# Altium project Mach cau H.PrjPcb
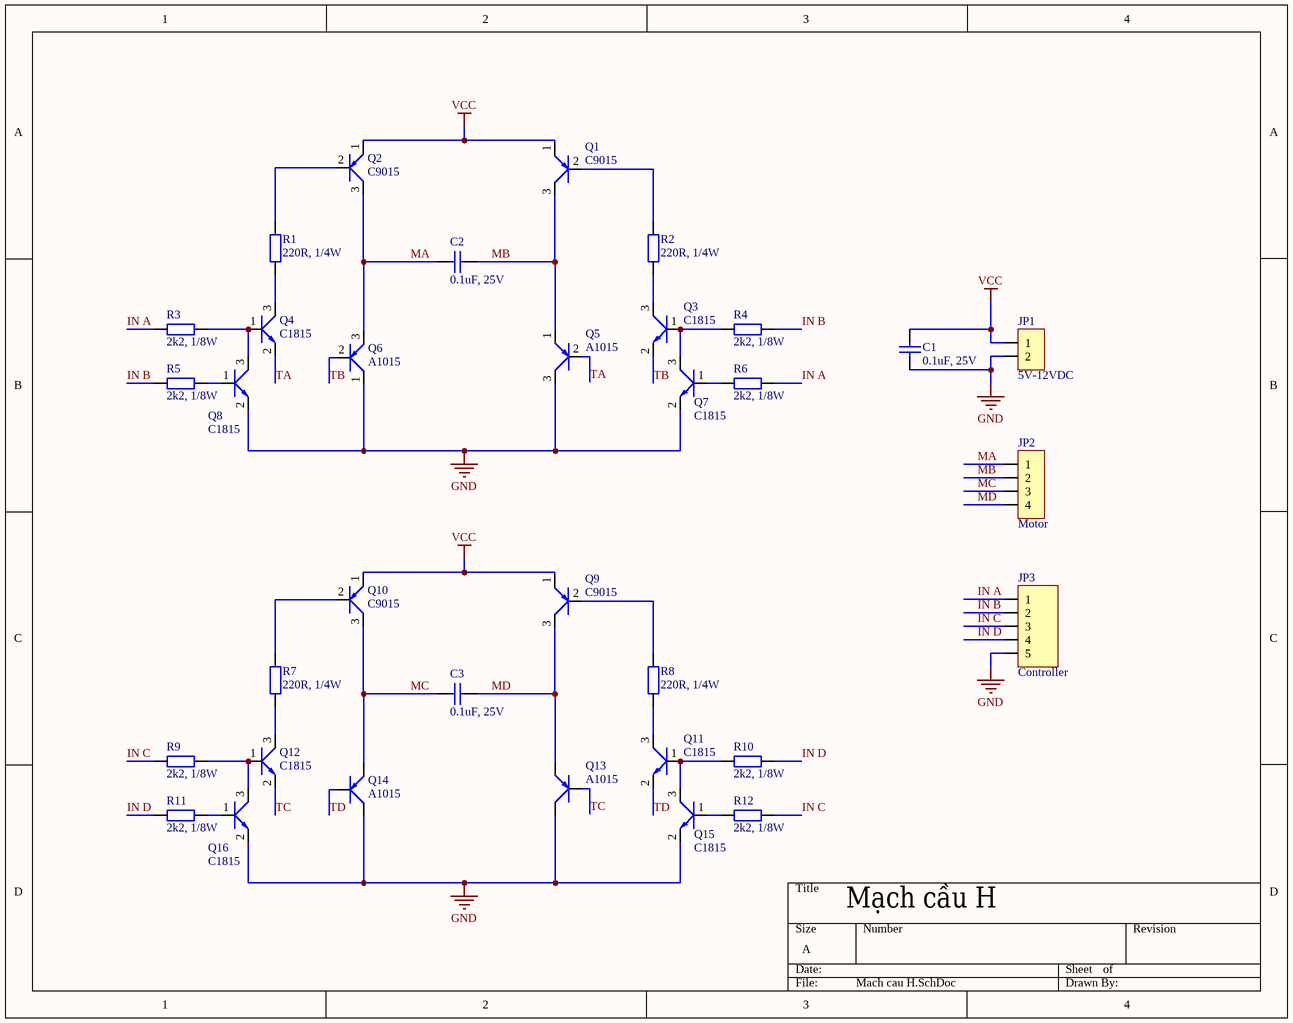
[diagram p0: Mach cau H.SchDoc]
1 sheet, 34 parts. Net scope: global (net labels, ports and power ports of the same name join across sheets).
Board file: Mach cau H.PcbDoc

## Sheet Mach cau H.SchDoc
size A; SheetNumber: 1; SheetTotal: 1

### Parts
C1  0.1uF, 25V  [tu gom]
C2  0.1uF, 25V  [tu gom]
C3  0.1uF, 25V  [tu gom]
JP1  5V-12VDC  [JP 1x2 CT]
JP2  Motor  [JP 1x4 CT]
JP3  Controller  [JP 1x5 CT]
Q1  C9015  [QTO-92]
Q2  C9015  [QTO-92]
Q3  C1815  [QTO-92]
Q4  C1815  [QTO-92]
Q5  A1015  [TO92]
Q6  A1015  [TO92]
Q7  C1815  [QTO-92]
Q8  C1815  [QTO-92]
Q9  C9015  [QTO-92]
Q10  C9015  [QTO-92]
Q11  C1815  [QTO-92]
Q12  C1815  [QTO-92]
Q13  A1015  [TO92]
Q14  A1015  [TO92]
Q15  C1815  [QTO-92]
Q16  C1815  [QTO-92]
R1  220R, 1/4W  [tro vach 1/4w]
R2  220R, 1/4W  [tro vach 1/4w]
R3  2k2, 1/8W  [R1/4W]
R4  2k2, 1/8W  [R1/4W]
R5  2k2, 1/8W  [R1/4W]
R6  2k2, 1/8W  [R1/4W]
R7  220R, 1/4W  [tro vach 1/4w]
R8  220R, 1/4W  [tro vach 1/4w]
R9  2k2, 1/8W  [R1/4W]
R10  2k2, 1/8W  [R1/4W]
R11  2k2, 1/8W  [R1/4W]
R12  2k2, 1/8W  [R1/4W]

### Nets
GND: C1.2 JP1.2 JP3.5 Q5.3(E) Q6.1(E) Q7.2(E) Q8.2(E) Q13.2(C) Q14.2(C) Q15.2(E) Q16.2(E)
VCC: C1.1 JP1.1 Q1.1(E) Q2.1(E) Q9.1(E) Q10.1(E)
IN A: JP3.1 R3.1 R6.1
IN B: JP3.2 R4.1 R5.1
IN C: JP3.3 R9.1 R12.1
IN D: JP3.4 R10.1 R11.1
MA: C2.1 JP2.1 Q2.3(C) Q6.3(C)
MB: C2.2 JP2.2 Q1.3(C) Q5.1(C)
MC: C3.1 JP2.3 Q10.3(C) Q14.1(E)
MD: C3.2 JP2.4 Q9.3(C) Q13.1(E)
TA: Q4.2(E) Q5.2(B)
TB: Q3.2(E) Q6.2(B)
TC: Q12.2(E) Q13.3(B)
TD: Q11.2(E) Q14.3(B)
NetQ1_2: Q1.2(B) R2.2
NetQ2_2: Q2.2(B) R1.2
NetQ3_1: Q3.1(B) Q7.3(C) R4.2
NetQ3_3: Q3.3(C) R2.1
NetQ4_1: Q4.1(B) Q8.3(C) R3.2
NetQ4_3: Q4.3(C) R1.1
NetQ7_1: Q7.1(B) R6.2
NetQ8_1: Q8.1(B) R5.2
NetQ9_2: Q9.2(B) R8.2
NetQ10_2: Q10.2(B) R7.2
NetQ11_1: Q11.1(B) Q15.3(C) R10.2
NetQ11_3: Q11.3(C) R8.1
NetQ12_1: Q12.1(B) Q16.3(C) R9.2
NetQ12_3: Q12.3(C) R7.1
NetQ15_1: Q15.1(B) R12.2
NetQ16_1: Q16.1(B) R11.2

### Notes on the sheet
- Mạch cầu H

### Library data of the parts
C1-C3 = Tu gom 101 50V: Cắm; Don_Vi: Con; So_Chan: 2; Ten_Linh_Kien: Tụ gốm 101 0.1nF 50V; Ma_Hang: MH004764; Chung_Loai: Cắm; Kieu_Chan: *
JP1 = JP 1x2 2.54 Cai Thang: Cắm; Ten_Linh_Kien: Jump Đơn Cái 2.54MM 1x20P Thẳng; Don_Vi: Con; Ma_Hang: MH004006; Ghi_Chu: *; Kieu_Chan: *; Chung_Loai: Cắm
JP2 = JP 1x4 2.54 Cai Thang: Cắm; Ten_Linh_Kien: Jump Đơn Cái 2.54MM 1x20P Thẳng; Don_Vi: Con; Ma_Hang: MH004006; Ghi_Chu: *; Kieu_Chan: *; Chung_Loai: Cắm
JP3 = JP 1x5 2.54 Cai Thang: Cắm; Ten_Linh_Kien: Jump Đơn Cái 2.54MM 1x20P Thẳng; Don_Vi: Con; Ma_Hang: MH004006; Ghi_Chu: *; Kieu_Chan: *; Chung_Loai: Cắm
Q1 Q2 Q9 Q10 = PNP_EBC: P 600mW, EBC; Value: C9015
Q3 Q4 Q7 Q8 Q11 Q12 Q15 Q16 = C1815: NPN 600mW, ECB; Value: C1815
Q5 Q6 Q13 Q14 = A1015: PNP 600mW, ECB; Value: A1015
R1 R2 R7 R8 = Tro Vach 1/4W 5% 220R: Cắm; Don_Vi: Con; So_Chan: 2; Ten_Linh_Kien: Trở Vạch 1/4w 5% 220R; Ma_Hang: MH007300; Chung_Loai: Cắm; Kieu_Chan: *
R3-R6 R9-R12 = R1/4W: Resistor 1/4W; Value: R1/4W - 1K